# Altium schematic sheet MEZIFREKVENCE.SchDoc
size A4; SheetNumber: 3; SheetTotal: 3
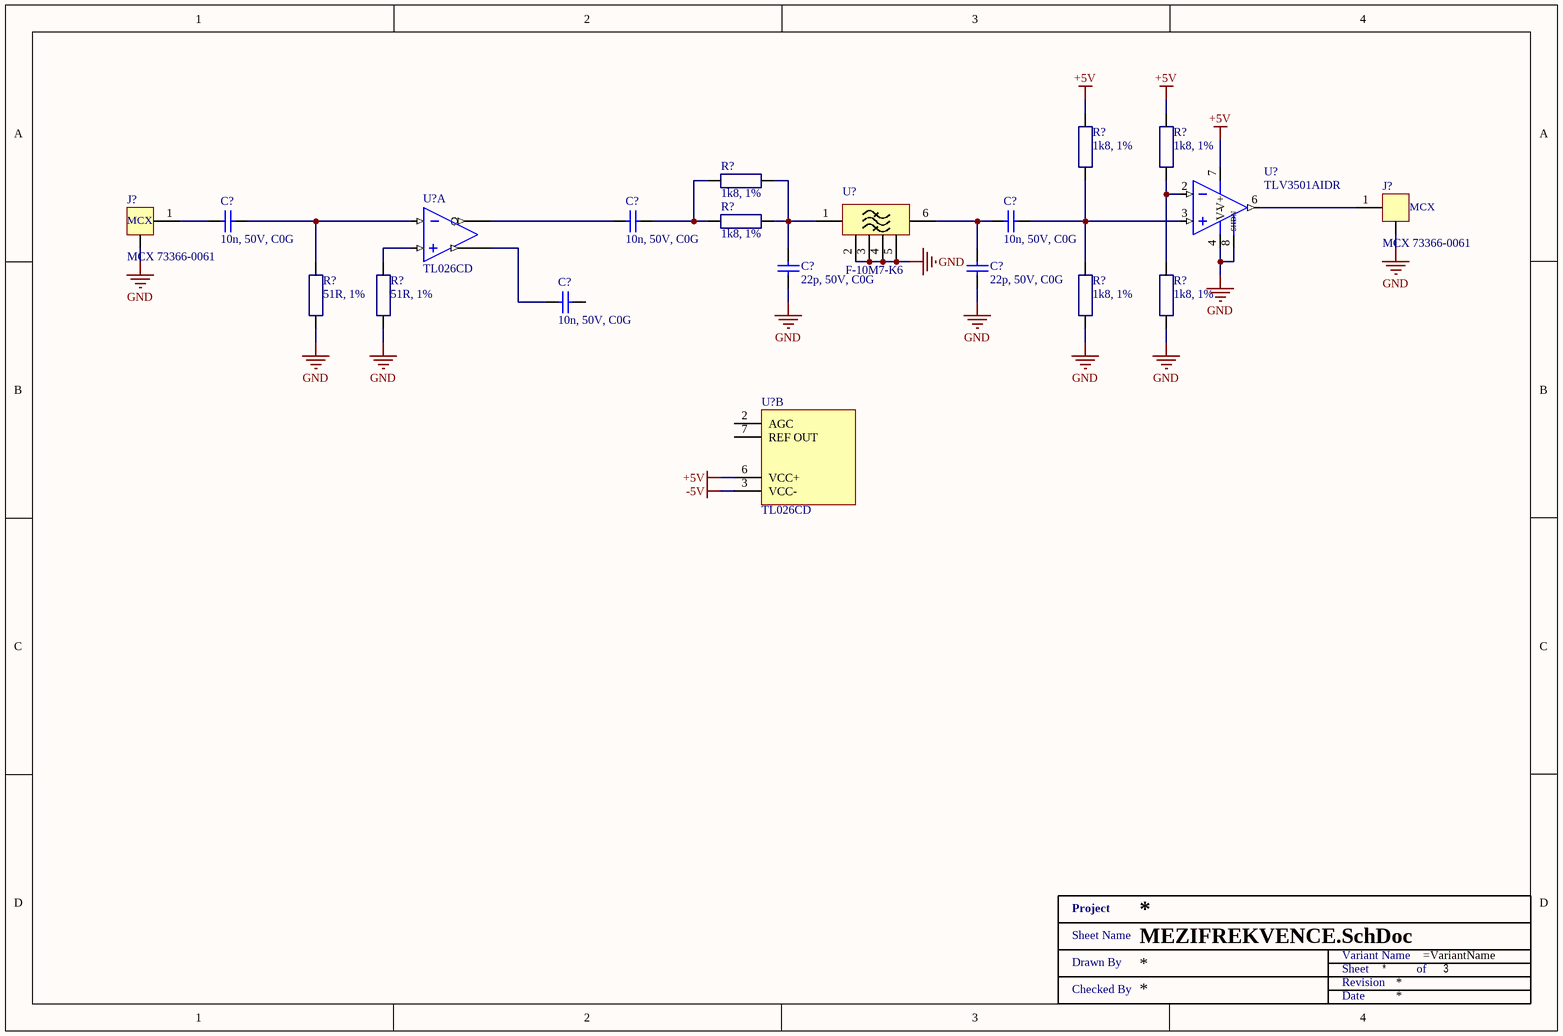
[diagram p0: MEZIFREKVENCE.SchDoc]

## Parts
(Parts that share a designator on the sheet are numbered #1, #2 ... from top to bottom, then left to right.)
C?#1  10n, 50V, C0G  [SMD0603]
C?#2  10n, 50V, C0G  [SMD0603]
C?#3  10n, 50V, C0G  [SMD0603]
C?#4  22p, 50V, C0G  [SMD0603]
C?#5  22p, 50V, C0G  [SMD0603]
C?#6  10n, 50V, C0G  [SMD0603]
J?#1  MCX 73366-0061  [73366-0061]
J?#2  MCX 73366-0061  [73366-0061]
R?#1  1k8, 1%  [SMD0603 - R]
R?#2  1k8, 1%  [SMD0603 - R]
R?#3  1k8, 1%  [SMD0603 - R]
R?#4  1k8, 1%  [SMD0603 - R]
R?#5  1k8, 1%  [SMD0603 - R]
R?#6  1k8, 1%  [SMD0603 - R]
R?#7  51R, 1%  [SMD0603 - R]
R?#8  51R, 1%  [SMD0603 - R]
U?#1  TLV3501AIDR  [SOIC08]
U?#2  F-10M7-K6  [F-10M7-K6]
U?#3  TL026CD  [SOIC08]  (part A of 2)
U?#4  TL026CD  [SOIC08]  (part B of 2)
XX?  Title 1  (value not drawn)  (graphical)

## Nets
+5V: R?#1.2 R?#2.2 U?#1.7(V+) U?#4.6(VCC+)
-5V: U?#4.3(VCC-)
GND: C?#4.1 C?#5.1 J?#1.2(GND) J?#2.2(GND) R?#5.1 R?#6.1 R?#7.1 R?#8.1 U?#1.4(V-) U?#1.8(SHDN) U?#2.2(GND) U?#2.3(GND) U?#2.4(GND) U?#2.5(GND)
NetC?#1_1: C?#1.1 J?#2.1(INPUT)
NetC?#1_2: C?#1.2 R?#7.2 U?#3.8(IN-)
NetC?#2_1: C?#2.1 U?#3.5(OUT-)
NetC?#2_2: C?#2.2 R?#3.2 R?#4.2
NetC?#3_1: C?#3.1 C?#5.2 U?#2.6(OUT)
NetC?#3_2: C?#3.2 R?#1.1 R?#5.2 U?#1.3(IN+)
NetC?#4_2: C?#4.2 R?#3.1 R?#4.1 U?#2.1(IN)
NetC?#6_1: C?#6.1 U?#3.4(OUT+)
NetJ?#1_1: J?#1.1(INPUT) U?#1.6(OUT)
NetR?#2_1: R?#2.1 R?#6.2 U?#1.2(IN-)
NetR?#8_2: R?#8.2 U?#3.1(IN+)

Not connected (* = marked no-connect by the designer): C?#6 2; U?#4 2(AGC) 7(REF_OUT)

## Notes on the sheet
- (in symbol Title 1) Project; Sheet Name; Variant Name; Drawn By; Sheet; of; Revision; Checked By; Date

## Library data of the parts
C?#1-C?#3 C?#6 = GRM1885C1H103JA01D: Multilayer Ceramic Capacitors MLCC - SMD/SMT 0603 50VDC 10000pF 5% C0G; Manufacturer: Murata Electronics; Type: Chip Multilayer Ceramic Capacitor for General Purpose; Capacitance - nF: 10 nF; Class: Class 1; CNHTS: 8532241000; Dielectric: C0G (NP0); TARIC: 8532240000; Supplier 1: Mouser; Supplier Part Number 1: 81-GRM1885C1H103JA1D; Manufacturer Part Number: GRM1885C1H103JA01D; RoHS: RoHS Compliant; Category: Multilayer Ceramic Capacitors MLCC - SMD/SMT; Stock 1: 217291; Pricing 1: 1=0.183, 10=0.129, 100=0.065, 500=0.045, 1000=0.039, 4000=0.030, 8000=0.027, 24000=0.025 (EUR); Capacitance: 10n; Height: 0.8 mm; Length: 1.6 mm; Package / Case: 0603 (1608 metric); Packaging: Cut Tape; Product: General Type MLCCs; Series: GRM; Termination Style: SMD/SMT; Tolerance: 5 %; Voltage Rating DC: 50 VDC; Width: 0.8 mm; Brand: Murata Electronics; Capacitance - pF: 10000 pF; Case Code - in: 0603; Case Code - mm: 1608; HTS Code: 8532240020; Maximum Operating Temperature: + 125 C; Minimum Operating Temperature: - 55 C; Product Type: Ceramic Capacitors; Standard Pack Qty: 4000; Subcategory: Capacitors; Termination: Standard; RoHS - Mouser: Y; Minimum Order Quantity: 1; Reeling: True; ComponentLink1URL: http://www.mouser.com/datasheet/2/281/murata_03052018_GRM_Series_1-1310166.pdf; ComponentLink1Description: http://www.mouser.com/datasheet/2/281/murata_03052018_GRM_Series_1-1310166.pdf; Supplier 2: Farnell; Supplier Part Number 2: 2456107
C?#4 C?#5 = MC0603N220J500CT: MULTICOMP - MC0603N220J500CT - CAP, MLCC, C0G/NP0, 22PF, 50V, 0603; Manufacturer: MULTICOMP; Manufacturer Part Number: MC0603N220J500CT; RoHS: YES; Stock 1: 184439; Pricing 1: 10=0.0077, 100=0.0065, 500=0.0052, 1000=0.0044, 2000=0.0038 (GBP); ComponentLink1URL: http://www.farnell.com/datasheets/1901289.pdf; ComponentLink1Description: http://www.farnell.com/datasheets/1901289.pdf; Capacitance: 22p; Supplier 1: Farnell; Supplier Part Number 1: 1759057; Supplier 2: Newark; Supplier Part Number 2: 94W8766
J?#1 J?#2 = 73366-0061: CONN MCX JACK STR 50 OHM PCB; Manufacturer: Molex, LLC; Manufacturer Part Number: 0733660061; Connector Type: Jack, Female Socket; Contact Termination: Solder; Impedance: 50 Ohm; Body Material: Brass; Body Finish: Gold; Dielectric Material: Polytetrafluoroethylene (PTFE); Center Contact Material: Beryllium Copper; Mating Cycles: 500; RoHS: RoHS Compliant; Category: Connectors, Interconnects; Stock 1: 39394; Pricing 1: 1=1.95, 10=1.765, 25=1.6572, 50=1.5854, 100=1.5133, 250=1.36916, 500=1.26106, 1000=1.0809, 2500=1.00884 (USD); Packaging: Tray; Part Status: Active; Connector Style: MCX; Shield Termination: Solder; Mounting Type: Through Hole; Mounting Feature: -; Cable Group: -; Fastening Type: Snap-On; Features: -; Housing Color: Gold; Ingress Protection: -; Includes: -; Center Contact Plating: Gold; Operating Temperature: -55°C ~ 155°C; Insertion Loss: -; ComponentLink1URL: https://www.molex.com/pdm_docs/sd/733660061_sd.pdf; ComponentLink1Description: https://www.molex.com/pdm_docs/sd/733660061_sd.pdf; Supplier 1: Mouser; Supplier Part Number 1: 538-73366-0061; Supplier 2: Digi-Key; Supplier Part Number 2: WM5541-ND; Supplier 3: Farnell; Supplier Part Number 3: 1909245
R?#1-R?#6 = RC0603FR-071K8L: Res Thick Film 0603 1.8K Ohm 1% 0.1W(1/10W) ±100ppm/C Molded SMD Paper T/R; Manufacturer: Yageo; Voltage Rating (DC): 50V; Temperature Coefficient: 100ppm/°C; Max Power Dissipation: 100mW; Supplier 1: Mouser; Supplier Part Number 1: 603-RC0603FR-071K8L; Manufacturer Part Number: RC0603FR-071K8L; RoHS: Yes; Category: Chip SMD Resistors; Stock 1: 505177; Pricing 1: 1=0,10000, 10=0,01800, 100=0,00600, 1000=0,00500, 5000=0,00300, 10000=0,00300 (USD); Case/Package: 0603; Number of Pins: 2; Case Code (Metric): 1608; Case Code (Imperial): 0603; Min Operating Temperature: -55°C; Max Operating Temperature: 155°C; Resistance: 1k8; Tolerance: 1%; Composition: Thick Film; Packaging: Tape and Reel; Features: Moisture Resistant; Power Rating: 100mW; Voltage Rating: 50V; Number of Terminations: 2; Package Quantity: 5000; Termination: SMD/SMT; Military Standard: Not; Length: 1.6mm; Height: 0.45mm; Width: 0.8mm; Depth: 0.8mm; Lead Free: Lead Free; REACH SVHC: No SVHC; ComponentLink1URL: https://datasheet.ciiva.com/11808/0900766b80f96399-11808105.pdf?src-supplier=RSComponents; ComponentLink1Description: https://datasheet.ciiva.com/11808/0900766b80f96399-11808105.pdf?src-supplier=RSComponents; ComponentLink2URL: https://datasheet.ciiva.com/2519/pyu-r-int-thick-7-2519189.pdf?src-supplier=Digi-Key; ComponentLink2Description: https://datasheet.ciiva.com/2519/pyu-r-int-thick-7-2519189.pdf?src-supplier=Digi-Key; ComponentLink3URL: https://datasheet.ciiva.com/7746/443971-7746277.pdf?src-supplier=Element14; ComponentLink3Description: https://datasheet.ciiva.com/7746/443971-7746277.pdf?src-supplier=Element14; ComponentLink4URL: https://datasheet.ciiva.com/2519/pyu-r-int-thick-7-2519190.pdf?src-supplier=Digi-Key; ComponentLink4Description: https://datasheet.ciiva.com/2519/pyu-r-int-thick-7-2519190.pdf?src-supplier=Digi-Key; ComponentLink5URL: https://datasheet.ciiva.com/7746/443971-7746278.pdf?src-supplier=Element14; ComponentLink5Description: https://datasheet.ciiva.com/7746/443971-7746278.pdf?src-supplier=Element14; ComponentLink6URL: https://datasheet.ciiva.com/12558/rc0603-272842-12558694.pdf?src-supplier=Mouser; ComponentLink6Description: https://datasheet.ciiva.com/12558/rc0603-272842-12558694.pdf?src-supplier=Mouser; ComponentLink7URL: https://datasheet.ciiva.com/2519/pyu-r-int-thick-7-2519191.pdf?src-supplier=Digi-Key; ComponentLink7Description: https://datasheet.ciiva.com/2519/pyu-r-int-thick-7-2519191.pdf?src-supplier=Digi-Key; Supplier 2: Digi-Key; Supplier Part Number 2: 311-1.80KHRCT-ND; Supplier 3: Farnell; Supplier Part Number 3: 2693664
R?#7 R?#8 = CRCW060351R0FKEA: RES SMD 51 OHM 1% 1/10W 0603; Manufacturer: Vishay Dale; Power (Watts): 0.1W, 1/10W; Temperature Coefficient: ±100ppm/°C; Manufacturer Part Number: CRCW060351R0FKEA; RoHS: RoHS Compliant; Category: Resistors; Stock 1: 21691; Pricing 1: 1=0.1, 10=0.042, 100=0.017, 1000=0.00764, 2500=0.00663 (USD); Packaging: Cut Tape (CT); Part Status: Active; Tolerance: ±1%; Composition: Thick Film; Features: Automotive AEC-Q200; Operating Temperature: -55°C ~ 155°C; Package / Case: 0603 (1608 Metric); Supplier Device Package: 0603; Size / Dimension: 0.063" L x 0.033" W (1.60mm x 0.85mm); Height - Seated (Max): 0.020" (0.50mm); Failure Rate: -; ComponentLink1URL: http://www.vishay.com/docs/20035/dcrcwe3.pdf; ComponentLink1Description: http://www.vishay.com/docs/20035/dcrcwe3.pdf; Resistance: 51R; Supplier 1: Mouser; Supplier Part Number 1: 71-CRCW0603-51-E3; Supplier 2: Farnell; Supplier Part Number 2: 1652889; Supplier 3: Digi-Key; Supplier Part Number 3: 541-51.0HCT-ND
U?#1 = TLV3501AIDR: Rail-to-Rail, High-Speed Comparator in Microsize Packages; Manufacturer: Texas Instruments; Number of Elements: 1; Propagation Delay: 10ns; Max Supply Voltage: 5.5V; Min Supply Voltage: 2.7V; Common Mode Rejection Ratio: 70dB; Nominal Supply Current: 5mA; Input Offset Voltage (Vos): 6.5mV; Input Bias Current: 10pA; Hysteresis: 6mV; Power Supply Rejection Ratio (PSRR): 100dB; Response Time: 0.0045us; Output Current: 74mA; Output Type: TTL,PUSH-PULL; Supplier 1: Mouser; Supplier Part Number 1: 595-TLV3501AIDR; Manufacturer Part Number: TLV3501AIDR; RoHS: Yes; Category: Amplifiers - Op Amps, Buffer, Instrumentation; Stock 1: 2140; Pricing 1: 1=3.15000, 10=2.83000, 50=2.68000, 100=2.32000, 1000=1.73000, 10000=1.72000 (USD); Mount: Surface Mount; Case/Package: SOIC; Number of Pins: 8; Weight: 0.002677oz; Min Operating Temperature: -40°C; Max Operating Temperature: 125°C; Package Quantity: 2500; Packaging: Tape and Reel; Quiescent Current: 5mA; Max Supply Current: 5mA; Number of Channels: 1; Type: General Purpose; Series: -; Supply Current: 5mA; Technology: CMOS; Max Input Current: 10pA; Radiation Hardening: No; Lead Free: Lead Free; RoHS Compliant: Yes; ComponentLink1URL: https://datasheet.ciiva.com/1830/tlv3501-1830016.pdf?src-supplier=Digi-Key; ComponentLink1Description: https://datasheet.ciiva.com/1830/tlv3501-1830016.pdf?src-supplier=Digi-Key; ComponentLink2URL: https://datasheet.ciiva.com/14392/tlv3501-14392108.pdf?src-supplier=Avnet; ComponentLink2Description: https://datasheet.ciiva.com/14392/tlv3501-14392108.pdf?src-supplier=Avnet; Supplier 2: Digi-Key; Supplier Part Number 2: 296-43611-1-ND; Supplier 3: Arrow Electronics; Supplier Part Number 3: TLV3501AIDR
U?#2 = F-10M7-K6: 10.7 MHz crystal band-pass filter, 8 poles / - Bandwidth (-3dB): 12 KHz / - Selectivity: 90 dB / - Impedance: 900 Ω / - Dimensions: 38 x 18 mm, h 12 mm
U?#3 U?#4 = TL026CD: Differential High-Frequency Amplifier with AGC 8-SOIC 0 to 70; Manufacturer: Texas Instruments; Common Mode Rejection Ratio: 60dB; Max Power Dissipation: 725mW; -3db Bandwidth: 50MHz; Nominal Supply Current: 27mA; Max Dual Supply Voltage: 8V; Min Dual Supply Voltage: 3V; Dual Supply Voltage: 6V; Voltage Gain: 38.59dB; Number of Channels: 1; Input Bias Current: 30uA; Operating Supply Current: 22mA; Output Current per Channel: 4mA; Operating Supply Voltage: 16V; Supplier 1: Mouser; Supplier Part Number 1: 595-TL026CD; Manufacturer Part Number: TL026CD; RoHS: Yes; Category: Amplifiers - Op Amps, Buffer, Instrumentation; Stock 1: 1672; Pricing 1: 1=2.57000, 10=2.46000, 50=2.46000, 100=2.45000, 1000=2.45000, 10000=1.45000 (USD); Case/Package: D; Number of Pins: 8; Weight: 0.002561oz; Min Operating Temperature: 0°C; Max Operating Temperature: 70°C; Packaging: Rail/Tube; Package Quantity: 75; Bandwidth: 50MHz; Number of Circuits: 1; Supply Current: 27mA; Series: TL026; Max Supply Voltage: 8V; Min Supply Voltage: 3V; Number of Elements: 1; Power Dissipation: 725mW; Number of Amplifiers: 1; Technology: JFET; Length: 4.9mm; Width: 3.91mm; Height: 1.58mm; Radiation Hardening: No; Lead Free: Lead Free; RoHS Compliant: Yes; REACH SVHC: No SVHC; ComponentLink1URL: https://datasheet.ciiva.com/26857/tl026cd-26857756.pdf?src-supplier=IIIC; ComponentLink1Description: https://datasheet.ciiva.com/26857/tl026cd-26857756.pdf?src-supplier=IIIC; ComponentLink2URL: https://datasheet.ciiva.com/28430/slfs007a-28430037.pdf?src-supplier=Avnet+Europe; ComponentLink2Description: https://datasheet.ciiva.com/28430/slfs007a-28430037.pdf?src-supplier=Avnet+Europe; ComponentLink3URL: https://datasheet.ciiva.com/26815/getdatasheetpartid-48553-26815191.pdf?src-supplier=Verical; ComponentLink3Description: https://datasheet.ciiva.com/26815/getdatasheetpartid-48553-26815191.pdf?src-supplier=Verical; ComponentLink4URL: https://datasheet.ciiva.com/1488/1835114-1488075.pdf?src-supplier=Element14; ComponentLink4Description: https://datasheet.ciiva.com/1488/1835114-1488075.pdf?src-supplier=Element14; ComponentLink5URL: https://datasheet.ciiva.com/1824/tl026-1824398.pdf?src-supplier=Digi-Key; ComponentLink5Description: https://datasheet.ciiva.com/1824/tl026-1824398.pdf?src-supplier=Digi-Key; ComponentLink6URL: https://datasheet.ciiva.com/48712/001011461-da-01-en-agc-video-amplifier-tl026cd-soic-8-tid-48712348.pdf?src-supplier=Conrad; ComponentLink6Description: https://datasheet.ciiva.com/48712/001011461-da-01-en-agc-video-amplifier-tl026cd-soic-8-tid-48712348.pdf?src-supplier=Conrad; Supplier 2: Farnell; Supplier Part Number 2: 1459444; Supplier 3: Digi-Key; Supplier Part Number 3: 296-11818-5-ND